# EAGLE schematic scrubinatorBaseschematics (EAGLE 9.4.2)
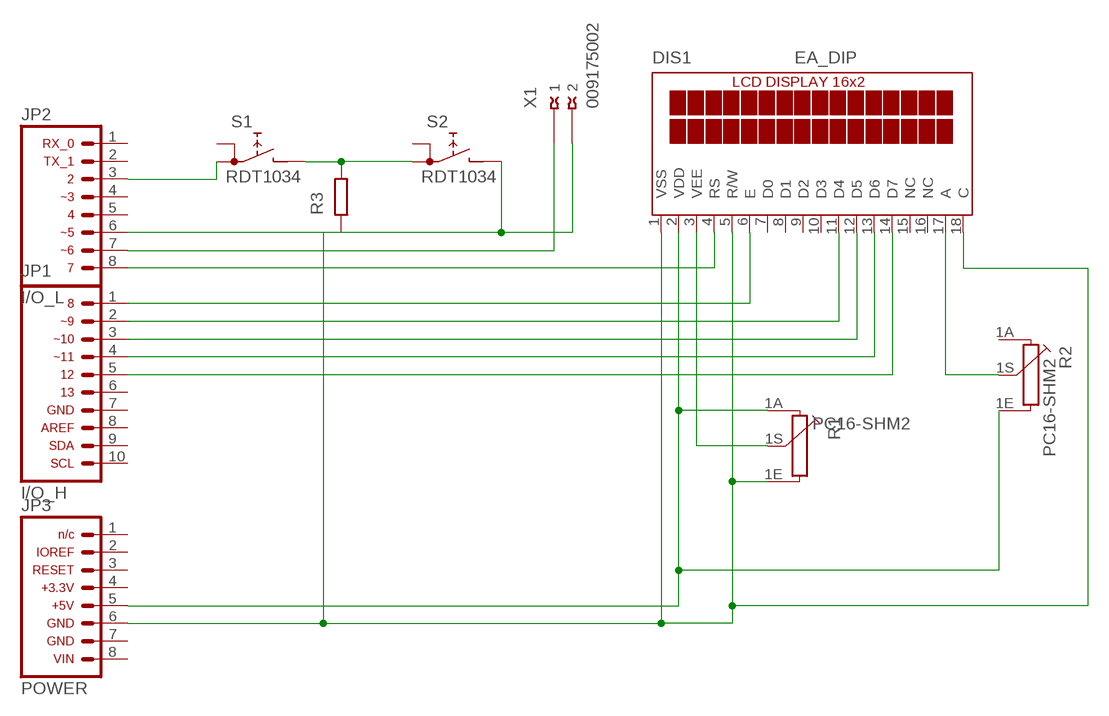
[diagram p0: schematic, sheet 1]

## Parts
DIS1  EA_DIP  [EA_DIP]
JP1  ARDUINO_CONN-IO_HSIP  [CONN-1X10]
JP2  ARDUINO_CONN-IO_LSIP  [CONN-1X08]
JP3  ARDUINO_CONN-POWERSIP  [CONN-1X08]
R1  PC16-SHM2  [PC16-SHM2]
R2  PC16-SHM2  [PC16-SHM2]
R3  R  (no package)
S1  RDT1034  [RDT1034]
S2  RDT1034  [RDT1034]
X1  009175002  [009175002]

## Nets
N$1: DIS1.2(VDD) JP3.5 R1.1A R2.1E
N$2: DIS1.1(VSS) DIS1.5(R/W) DIS1.18(C) JP3.6 R1.1E R3.1
N$3: DIS1.4(RS) JP2.8
N$4: DIS1.6(E) JP1.1
N$5: DIS1.11(D4) JP1.2
N$6: DIS1.12(D5) JP1.3
N$7: DIS1.13(D6) JP1.4
N$8: DIS1.14(D7) JP1.5
N$9: DIS1.3(VEE) R1.1S
N$10: DIS1.17(A) R2.1S
N$11: JP2.3 S1.A1
N$12: R3.2 S1.B S2.A1
N$13: JP2.6 S2.B X1.2@1
N$14: JP2.7 X1.1@1
Unconnected: DIS1.7(D0) DIS1.8(D1) DIS1.9(D2) DIS1.10(D3) DIS1.15(NC) DIS1.16(NC) JP1.6 JP1.7 JP1.8 JP1.9 JP1.10 JP2.1 JP2.2 JP2.4 JP2.5 JP3.1 JP3.2 JP3.3 JP3.4 JP3.7 JP3.8 R1.M1 R1.M2 R1.M3 R1.M4 R2.1A R2.M1 R2.M2 R2.M3 R2.M4 S1.A S2.A X1.1 X1.2

## Library data of the parts
DIS1 = display-lcd:EA_DIP: LCD-MODUL 2x16 - 6,68mm, INKL. KONTROLLER HD44780 Source: Data sheet <http://www.lcd-module.de/pdf/doma/dip162-d.pdf>
JP1 = arduino_jw:ARDUINO_CONN-IO_H: Arduino Digital I/O [High Byte] Header This is the Digital I/O [high byte] header on the Arduino Uno R3. This connector is labeled with the following pin assignments: Digital 8 Digital 9 [PWM] Digital 10 [PWM] Digital 11 [PWM] Digital 12 Digital 13 GND AREF SDA SCL NOTE: Be sure you install this connector with the correct orientation on your PCB layout. Pin 1 has a square pad to assist with orientation.
JP2 = arduino_jw:ARDUINO_CONN-IO_L: Arduino Digital I/O [Low Byte] Header This is the Digital I/O [low byte] header on the Arduino Uno R3. This connector is labeled with the following pin assignments: Digital 0, Serial Rx Digital 1, Serial Tx Digital 2 Digital 4 Digital 5 [PWM] Digital 6 [PWM] Digital 7 NOTE: Be sure you install this connector with the correct orientation on your PCB layout. Pin 1 has a square pad to assist with orientation.
JP3 = arduino_jw:ARDUINO_CONN-POWER: Arduino Power Header This is the power header on the Arduino Uno R3. This connector is labeled with the following pin assignments: n/c IO Ref RESET +3.3V +5V GND GND VIN NOTE: Be sure you install this connector with the correct orientation on your PCB layout. Pin 1 has a square pad to assist with orientation.
R1 R2 = piher:PC16-SHM2: POTENTIOMETER single carbon potentiometer, 16 mm, S3ROH; OC_FARNELL: unknown; OC_NEWARK: unknown
R3 = ngspice-simulation:R: RESISTOR
S1 S2 = switch:RDT1034: PUSH SWITCH www.radiohm.com
X1 = con-avx:009175002: Wire to Board IDC Connector 2 WAY Source: http://www.avx.com/docs/Catalogs/9175.pdf; MPN: 009175002001006; OC_FARNELL: 1387484; OC_NEWARK: 40M7660